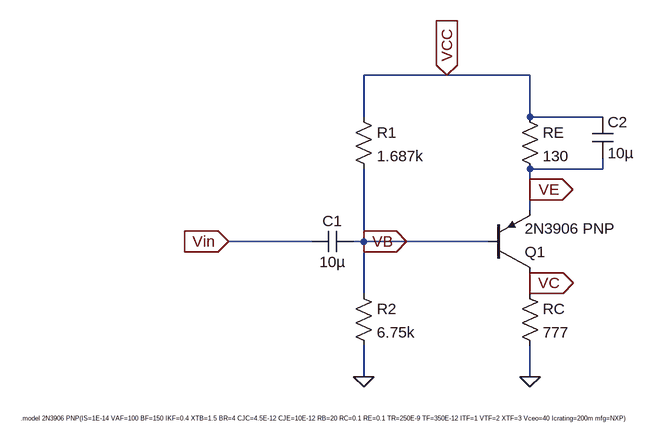
[diagram p0: schematic CE_pnp_Q2.asc]
CE_pnp_Q2.asc, the LTspice schematic file:
Version 4
SHEET 1 2152 808
WIRE 608 96 480 96
WIRE 736 96 608 96
WIRE 480 160 480 96
WIRE 736 160 736 96
WIRE 848 160 736 160
WIRE 848 240 848 224
WIRE 848 240 736 240
WIRE 736 272 736 240
WIRE 736 304 736 272
WIRE 400 352 272 352
WIRE 480 352 480 240
WIRE 480 352 464 352
WIRE 672 352 480 352
WIRE 736 416 736 400
WIRE 480 432 480 352
WIRE 736 432 736 416
WIRE 480 560 480 512
WIRE 736 560 736 512
FLAG 480 560 0
FLAG 736 560 0
FLAG 608 96 VCC
IOPIN 608 96 In
FLAG 272 352 Vin
IOPIN 272 352 In
FLAG 480 352 VB
IOPIN 480 352 Out
FLAG 736 416 VC
IOPIN 736 416 Out
FLAG 736 272 VE
IOPIN 736 272 Out
SYMBOL Res 464 144 R0
SYMATTR InstName R1
SYMATTR Value 1.687k
SYMBOL Res 464 416 R0
SYMATTR InstName R2
SYMATTR Value 6.75k
SYMBOL Res 720 144 R0
SYMATTR InstName RE
SYMATTR Value 130
SYMBOL Cap 464 336 R90
WINDOW 0 0 32 VBottom 2
WINDOW 3 32 32 VTop 2
SYMATTR InstName C1
SYMATTR Value 10µ
SYMBOL pnp 672 400 M180
SYMATTR InstName Q1
SYMATTR Value 2N3906 PNP
SYMBOL Res 720 416 R0
SYMATTR InstName RC
SYMATTR Value 777
SYMBOL Cap 832 160 R0
SYMATTR InstName C2
SYMATTR Value 10µ
TEXT -48 624 Left 0 !.model 2N3906 PNP(IS=1E-14 VAF=100 BF=150 IKF=0.4 XTB=1.5 BR=4 CJC=4.5E-12 CJE=10E-12 RB=20 RC=0.1 RE=0.1 TR=250E-9 TF=350E-12 ITF=1 VTF=2 XTF=3 Vceo=40 Icrating=200m mfg=NXP)

The netlist it stands for:
* CE_pnp_Q2.asc
R1 VCC VB 1.687k
R2 VB 0 6.75k
RE VCC VE 130
C1 VB Vin 10µ
Q1 VC VB VE 0 2N3906 PNP
RC VC 0 777
C2 VCC VE 10µ
.model NPN NPN
.model PNP PNP
.lib standard.bjt
.model 2N3906 PNP(IS=1E-14 VAF=100 BF=150 IKF=0.4 XTB=1.5 BR=4 CJC=4.5E-12 CJE=10E-12 RB=20 RC=0.1 RE=0.1 TR=250E-9 TF=350E-12 ITF=1 VTF=2 XTF=3 Vceo=40 Icrating=200m mfg=NXP)
.backanno
.end